# Altium schematic sheet Power.SchDoc
size B
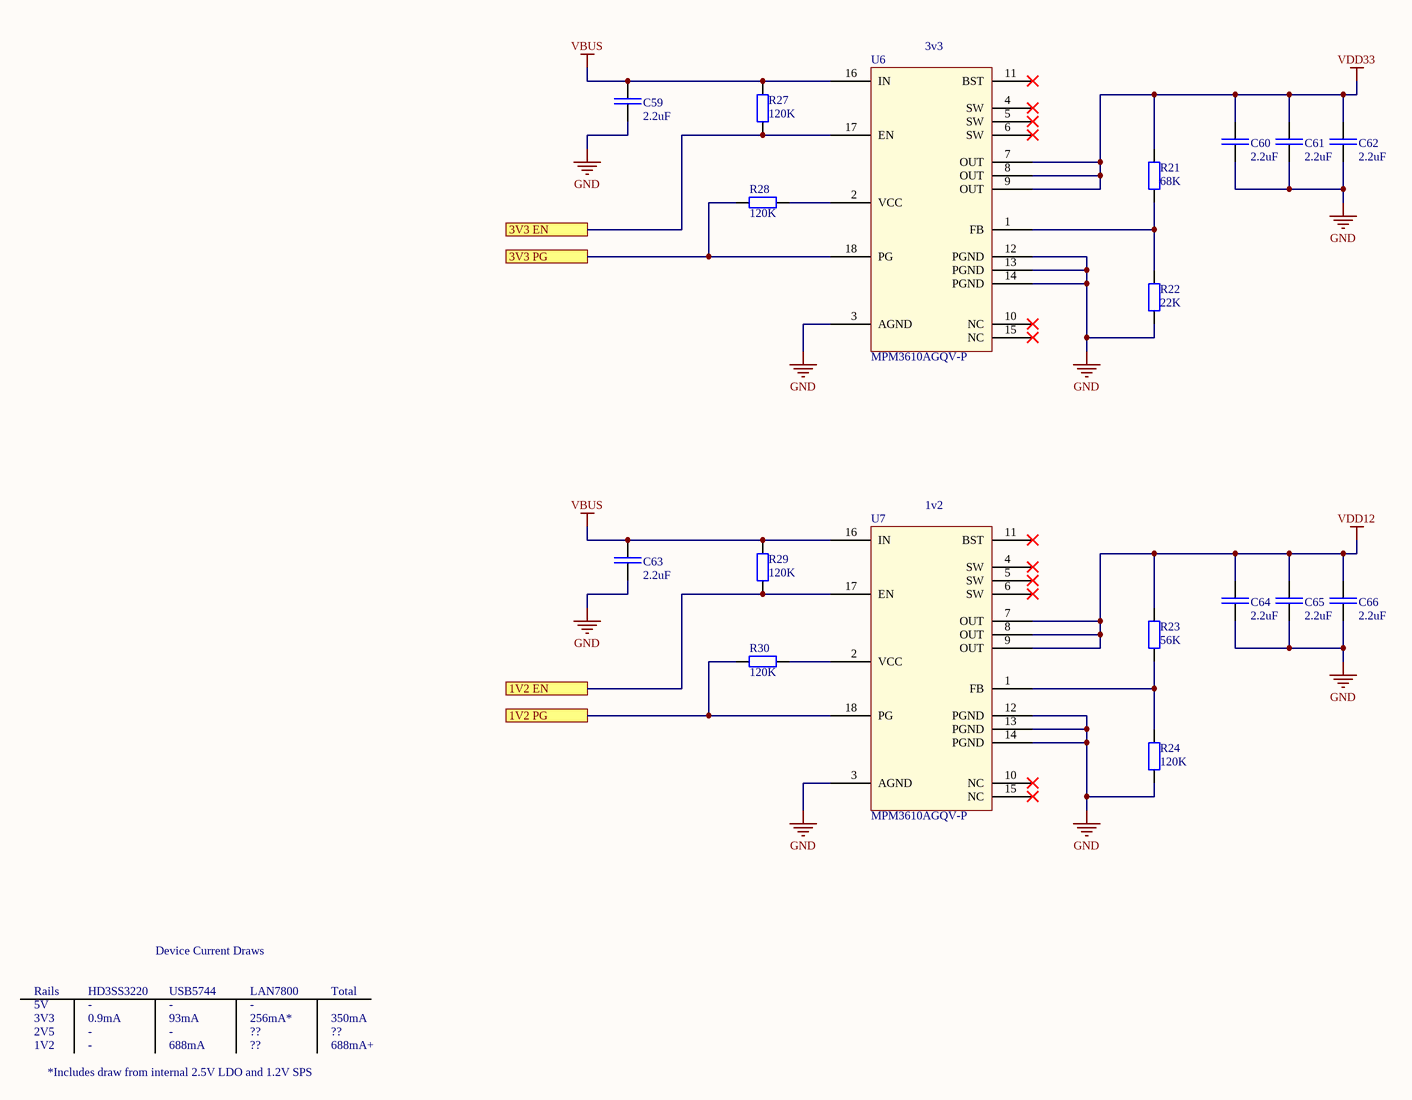
[diagram p0: Power.SchDoc]

## Parts
C59  2.2uF  [CAP_SM0805_YAGEOCC2_N]
C60  2.2uF  [CAP_SM0805_YAGEOCC2_N]
C61  2.2uF  [CAP_SM0805_YAGEOCC2_N]
C62  2.2uF  [CAP_SM0805_YAGEOCC2_N]
C63  2.2uF  [CAP_SM0805_YAGEOCC2_N]
C64  2.2uF  [CAP_SM0805_YAGEOCC2_N]
C65  2.2uF  [CAP_SM0805_YAGEOCC2_N]
C66  2.2uF  [CAP_SM0805_YAGEOCC2_N]
R21  68K  [RES_SM0603_YAGEORC_N]
R22  22K  [RES_SM0603_YAGEORC_N]
R23  56K  [RES_SM0603_YAGEORC_N]
R24  120K  [RES_SM0603_YAGEORC_N]
R27  120K  [RES_SM0603_YAGEORC_N]
R28  120K  [RES_SM0603_YAGEORC_N]
R29  120K  [RES_SM0603_YAGEORC_N]
R30  120K  [RES_SM0603_YAGEORC_N]
U6  MPM3610AGQV-P  [MPM3610AGQV-P]
U7  MPM3610AGQV-P  [MPM3610AGQV-P]

## Ports
1V2 EN, 1V2 PG, 3V3 EN, 3V3 PG

## Nets
GND: C59.2 C60.2 C61.2 C62.2 C63.2 C64.2 C65.2 C66.2 R22.1 R24.1 U6.3(AGND) U6.12(PGND) U6.13(PGND) U6.14(PGND) U7.3(AGND) U7.12(PGND) U7.13(PGND) U7.14(PGND)
VBUS: C59.1 C63.1 R27.1 R29.1 U6.16(IN) U7.16(IN)
VDD12: C64.1 C65.1 C66.1 R23.2 U7.7(OUT) U7.8(OUT) U7.9(OUT)
VDD33: C60.1 C61.1 C62.1 R21.2 U6.7(OUT) U6.8(OUT) U6.9(OUT)
1V2 EN: R29.2 U7.17(EN) ; port 1V2 EN
1V2 PG: R30.2 U7.18(PG) ; port 1V2 PG
3V3 EN: R27.2 U6.17(EN) ; port 3V3 EN
3V3 PG: R28.2 U6.18(PG) ; port 3V3 PG
NetR21_1: R21.1 R22.2 U6.1(FB)
NetR23_1: R23.1 R24.2 U7.1(FB)
NetR28_1: R28.1 U6.2(VCC)
NetR30_1: R30.1 U7.2(VCC)

Not connected (* = marked no-connect by the designer): U6 4(SW)* 5(SW)* 6(SW)* 10(NC)* 11(BST)* 15(NC)*; U7 4(SW)* 5(SW)* 6(SW)* 10(NC)* 11(BST)* 15(NC)*

## Notes on the sheet
- (near U6) 3v3
- (near U7) 1v2
- Device Current Draws
- Rails
- 3V3
- 1V2
- 2V5
- 5V
- HD3SS3220
- 0.9mA
- -
- USB5744
- 93mA
- 688mA
- LAN7800
- 256mA*
- ??
- Total
- 350mA
- 688mA+
- *Includes draw from internal 2.5V LDO and 1.2V SPS

## Library data of the parts
C59-C66 = CC0805KKX7R8BB225: CAP 2u2F SM0805 X7R 25V YAGEO CC2; Tolerance (%): 10; Voltage Rating (Volts): 25; Category: Capacitor; Manufacturer: Yageo; Manufacturer Part Number: CC0805KKX7R8BB225; Package: 0805; Value: 2.2uF; Supplier Part Number 1: 1458904; Supplier 1: Farnell; ComponentLink1URL: http://www.yageo.com; ComponentLink1Description: Manufacturer Website; Supplier 2: Digi-Key
R21 = RC0603FR-0768KL: RES 68K SM0603 YAGEO RC_L; Power (Watts): 0.1; Resistance (Ohms): 68000; Tolerance (%): 1; Category: Resistor; Manufacturer: Yageo; Manufacturer Part Number: RC0603FR-0768KL; Package: 0603; Value: 68K; Supplier Part Number 1: 9238700; Supplier 1: Farnell; ComponentLink1URL: http://www.yageo.com; ComponentLink1Description: Manufacturer Website; Supplier 2: Digi-Key; Supplier Part Number 2: 311-68.0KHRCT-ND
R22 = RC0603FR-0722KL: RES 22K SM0603 YAGEO RC_L; Power (Watts): 0.1; Resistance (Ohms): 22000; Tolerance (%): 1; Category: Resistor; Manufacturer: Yageo; Manufacturer Part Number: RC0603FR-0722KL; Package: 0603; Value: 22K; Supplier Part Number 1: 9238646; Supplier 1: Farnell; ComponentLink1URL: http://www.yageo.com; ComponentLink1Description: Manufacturer Website; Supplier 2: Digi-Key; Supplier Part Number 2: 311-22.0KHRCT-ND
R23 = RC0603FR-0756KL: RES 56K SM0603 YAGEO RC_L; Power (Watts): 0.1; Resistance (Ohms): 56000; Tolerance (%): 1; Category: Resistor; Manufacturer: Yageo; Manufacturer Part Number: RC0603FR-0756KL; Package: 0603; Value: 56K; Supplier Part Number 1: 9238697; Supplier 1: Farnell; ComponentLink1URL: http://www.yageo.com; ComponentLink1Description: Manufacturer Website; Supplier 2: Digi-Key; Supplier Part Number 2: 311-56KHRCT-ND
R24 R27-R30 = RC0603FR-07120KL: RES 120K SM0603 YAGEO RC_L; Power (Watts): 0.1; Resistance (Ohms): 120000; Tolerance (%): 1; Category: Resistor; Manufacturer: Yageo; Manufacturer Part Number: RC0603FR-07120KL; Package: 0603; Value: 120K; Supplier Part Number 1: 9238735; Supplier 1: Farnell; ComponentLink1URL: http://www.yageo.com; ComponentLink1Description: Manufacturer Website; Supplier 2: Digi-Key; Supplier Part Number 2: 311-120KHRCT-ND
U6 U7 = MPM3610AGQV-P: DC DC CONVERTER 0.8-18.48V